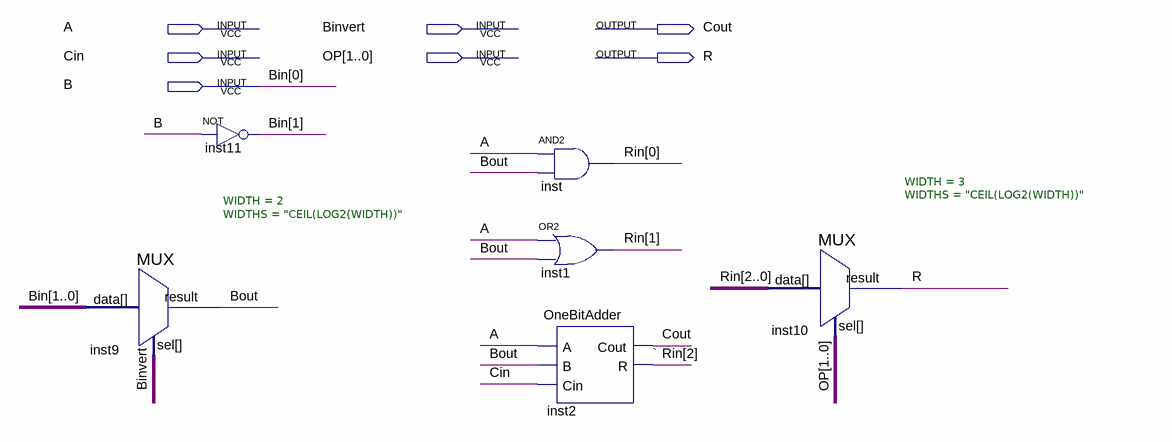
[diagram p0: schematic sheet]
// Quartus schematic OneBitaALU.bdf as structural Verilog: 6 symbols, 7 pins
module OneBitaALU (
  input  A,
  input  Binvert,
  input  Cin,
  input  [1:0] OP,
  input  B,
  output Cout,
  output R
);

  wire Bout;
  wire [1:1] Bin;
  wire [2:0] Rin;

  MUX #(.WIDTH(2), .WIDTHS("CEIL(LOG2(WIDTH))")) inst9 (.data({Bin[1], B}), .sel(Binvert), .result(Bout));
  not inst11 (Bin[1], B);
  and inst (Rin[0], A, Bout);
  or inst1 (Rin[1], A, Bout);
  OneBitAdder inst2 (.A(A), .B(Bout), .Cin(Cin), .Cout(Cout), .R(Rin[2]));
  MUX #(.WIDTH(3), .WIDTHS("CEIL(LOG2(WIDTH))")) inst10 (.data(Rin), .sel(OP), .result(R));

  // Other names for the same wires on the sheet: Bin[0] = B

  // Notes on the sheet:
  //   `
endmodule
